# Altium project BLBB.PrjPcb
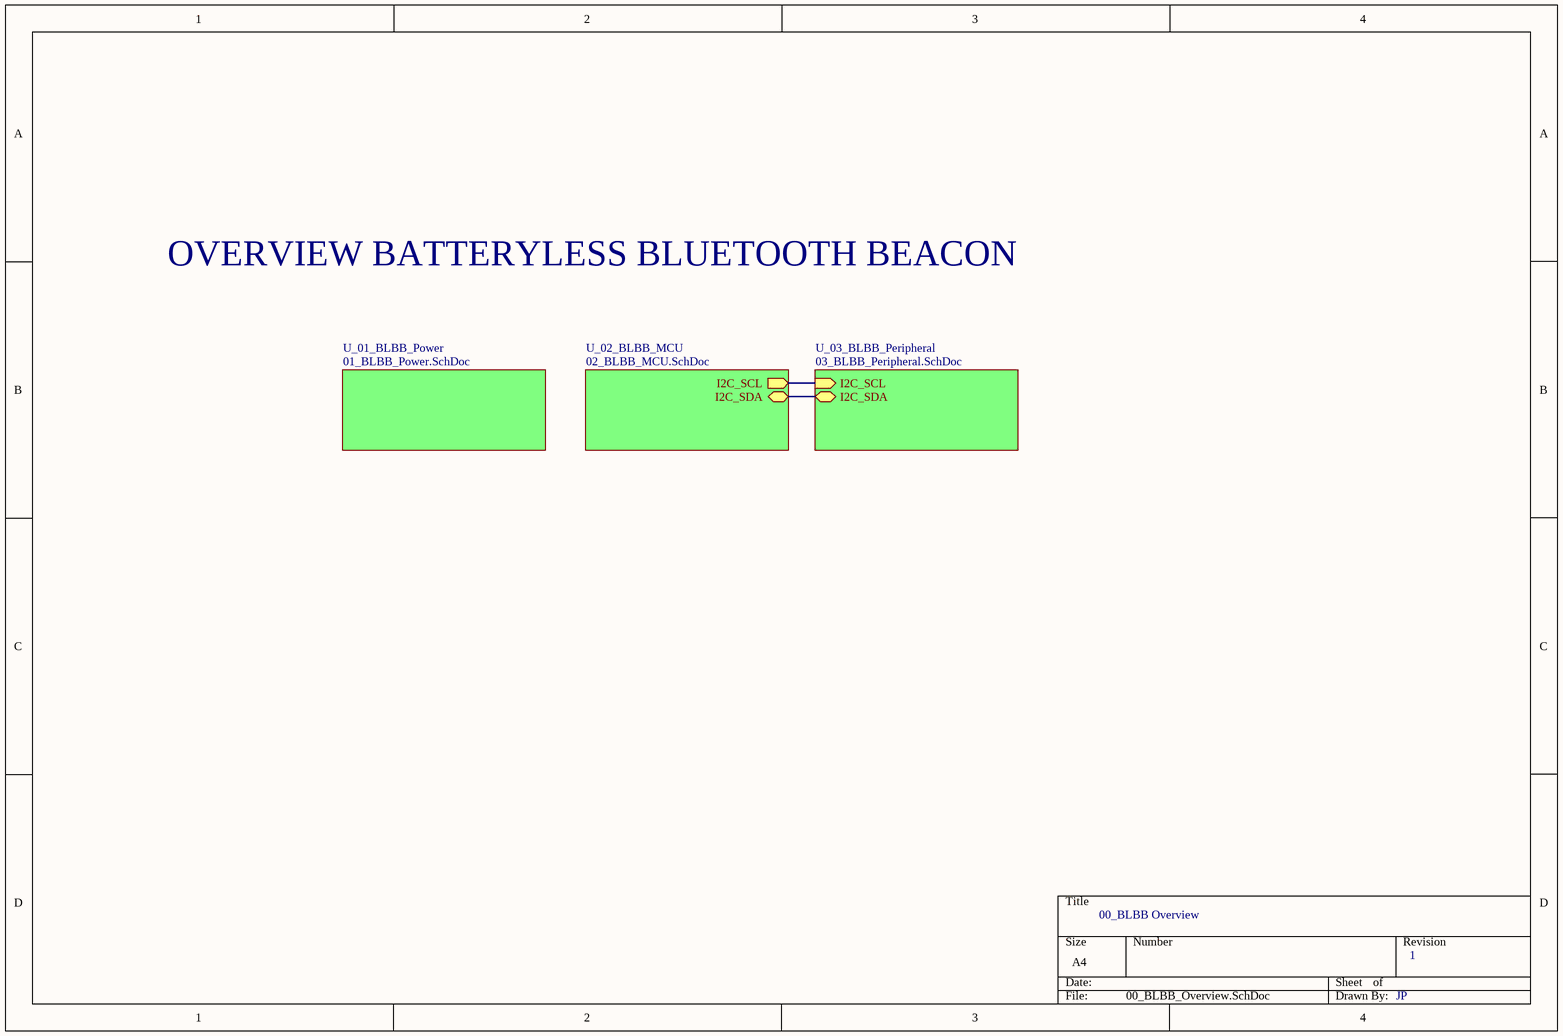
[diagram p0: 00_BLBB_Overview.SchDoc]
4 sheets, 46 parts. Net scope: hierarchical (ports join the sheet entries above them; power ports are global).
Board file: BLBB.PcbDoc
Sheets:
  00_BLBB_Overview.SchDoc
    U_01_BLBB_Power = 01_BLBB_Power.SchDoc
    U_02_BLBB_MCU = 02_BLBB_MCU.SchDoc
    U_03_BLBB_Peripheral = 03_BLBB_Peripheral.SchDoc

## Sheet 00_BLBB_Overview.SchDoc
size A4; SheetNumber: 1; SheetTotal: 4

### Sub-sheets
U_01_BLBB_Power = 01_BLBB_Power.SchDoc: no entries
U_02_BLBB_MCU = 02_BLBB_MCU.SchDoc: I2C_SCL (out), I2C_SDA (bidir)
U_03_BLBB_Peripheral = 03_BLBB_Peripheral.SchDoc: I2C_SCL (in), I2C_SDA (bidir)

### Nets
I2C_SCL: sheet U_02_BLBB_MCU/I2C_SCL, sheet U_03_BLBB_Peripheral/I2C_SCL
I2C_SDA: sheet U_02_BLBB_MCU/I2C_SDA, sheet U_03_BLBB_Peripheral/I2C_SDA

### Notes on the sheet
- OVERVIEW BATTERYLESS BLUETOOTH BEACON
- 00_BLBB Overview
- 1
- JP

## Sheet 01_BLBB_Power.SchDoc
size A4; SheetNumber: 2; SheetTotal: 4
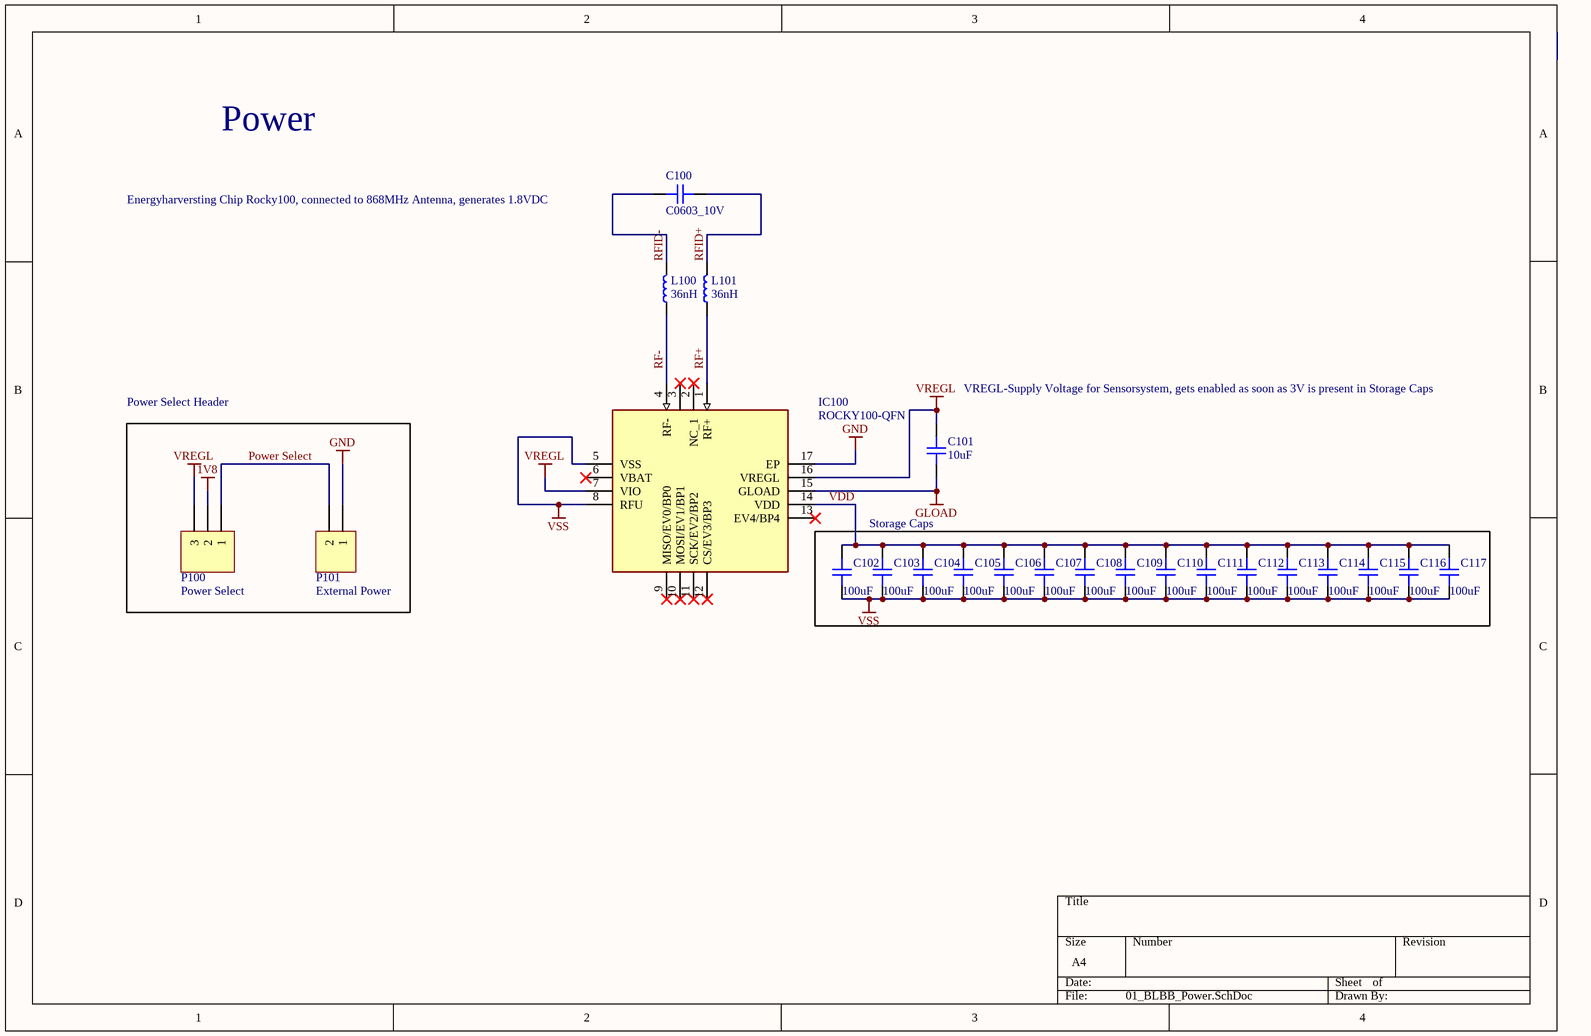
[diagram p1: 01_BLBB_Power.SchDoc]

### Parts
C100  C0603_10V  [CAP_0603]
C101  10uF  [CAP_0603]
C102  100uF  [CAP_1206]
C103  100uF  [CAP_1206]
C104  100uF  [CAP_1206]
C105  100uF  [CAP_1206]
C106  100uF  [CAP_1206]
C107  100uF  [CAP_1206]
C108  100uF  [CAP_1206]
C109  100uF  [CAP_1206]
C110  100uF  [CAP_1206]
C111  100uF  [CAP_1206]
C112  100uF  [CAP_1206]
C113  100uF  [CAP_1206]
C114  100uF  [CAP_1206]
C115  100uF  [CAP_1206]
C116  100uF  [CAP_1206]
C117  100uF  [CAP_1206]
IC100  ROCKY100-QFN  [QFN65P400X400X80-17N-D]
L100  36nH  [IND_0603]
L101  36nH  [IND_0603]
P100  Power Select  [HDR1X3]
P101  External Power  [HDR1X2]

### Blocks framed on the sheet
Power Select Header: P100 P101
Storage Caps: C102-C117

### Nets
1V8: P100.2
GLOAD: C101.1 IC100.15(GLOAD)
GND: IC100.17(EP) P101.1
VREGL: C101.2 IC100.7(VIO) IC100.16(VREGL) P100.3
VSS: C102.1 C103.1 C104.1 C105.1 C106.1 C107.1 C108.1 C109.1 C110.1 C111.1 C112.1 C113.1 C114.1 C115.1 C116.1 C117.1 IC100.5(VSS) IC100.8(RFU)
Power Select: P100.1 P101.2
RF+: IC100.1(RF+) L101.1
RF-: IC100.4(RF-) L100.1
RFID+: C100.2 L101.2
RFID-: C100.1 L100.2
VDD: C102.2 C103.2 C104.2 C105.2 C106.2 C107.2 C108.2 C109.2 C110.2 C111.2 C112.2 C113.2 C114.2 C115.2 C116.2 C117.2 IC100.14(VDD)

Not connected (* = marked no-connect by the designer): IC100 2(NC_1)* 3(NC_2)* 6(VBAT)* 9(MISO/EV0/BP0)* 10(MOSI/EV1/BP1)* 11(SCK/EV2/BP2)* 12(CS/EV3/BP3)* 13(EV4/BP4)*

### Notes on the sheet
- Power
- Energyharversting Chip Rocky100, connected to 868MHz Antenna, generates 1.8VDC
- (near C101) VREGL-Supply Voltage for Sensorsystem, gets enabled as soon as 3V is present in Storage Caps

### Library data of the parts
C100 C101 = CAP_0603_10V: Capacitor SMD 0603 10V
C102-C117 = CAP_1206_10V: Capacitor SMD 1206 10V
IC100 = ROCKY100-QFN: Integrated Circuit; Manufacturer_Name: Farsens; Datasheet Link: http://www.farsens.com/wp-content/uploads/2017/12/DS-ROCKY100-V04.pdf; Height: 0.8mm; Manufacturer_Part_Number: ROCKY100-QFN
L100 L101 = IND_0603: Inductor SMD 0603
P100 = Header 3: Header, 3-Pin; LatestRevisionDate: 17-Jul-2002; LatestRevisionNote: Re-released for DXP Platform.; Publisher: Altium Limited
P101 = Header 2: LatestRevisionDate: 17-Jul-2002; LatestRevisionNote: Re-released for DXP Platform.; Publisher: Altium Limited

## Sheet 02_BLBB_MCU.SchDoc
size A4; SheetNumber: 3; SheetTotal: 4
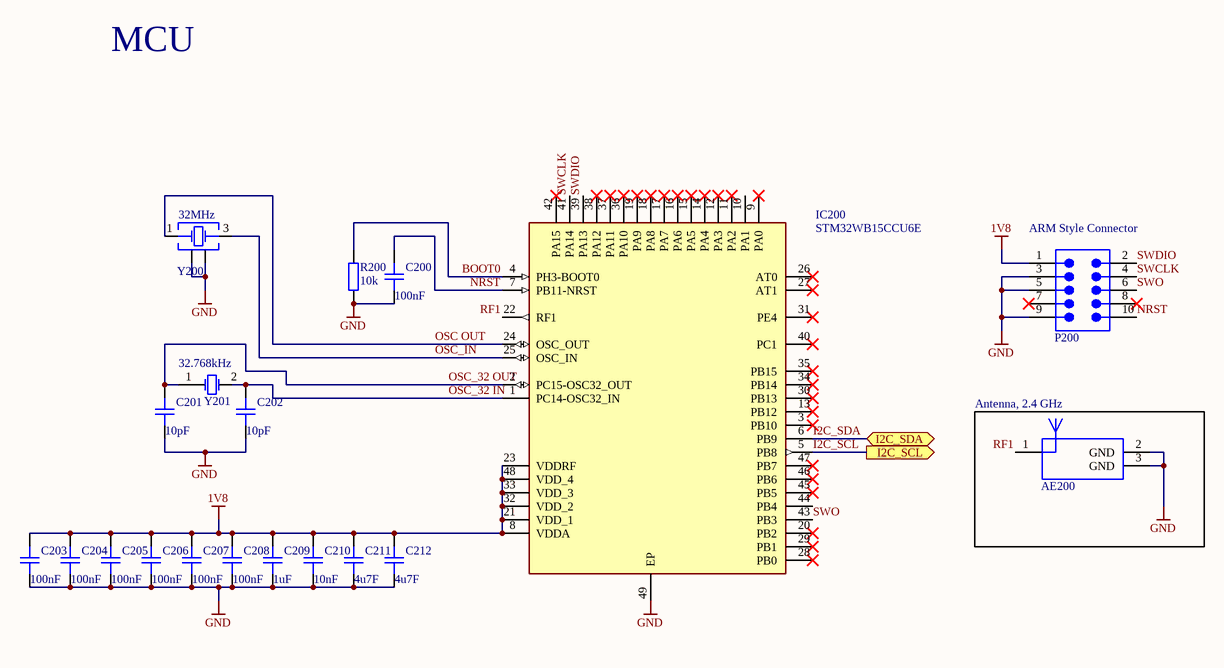
[diagram p2: 02_BLBB_MCU.SchDoc]

### Parts
AE200  7488960245  [7488960245]  (value not drawn)
C200  100nF  [CAP_0603]
C201  10pF  [CAP_0603]
C202  10pF  [CAP_0603]
C203  100nF  [CAP_0603]
C204  100nF  [CAP_0603]
C205  100nF  [CAP_0603]
C206  100nF  [CAP_0603]
C207  100nF  [CAP_0603]
C208  100nF  [CAP_0603]
C209  1uF  [CAP_0603]
C210  10nF  [CAP_0603]
C211  4u7F  [CAP_0603]
C212  4u7F  [CAP_0603]
IC200  STM32WB15CCU6E  [QFN50P700X700X65-49N-D]
P200  62701020621  [62701020621]  (value not drawn)
R200  10k  [RES_0603]
Y200  32MHz  [WE-XTAL_CFPX-180]
Y201  32.768kHz  [WE-XTAL_CFPX-217]

### Blocks framed on the sheet
Antenna, 2.4 GHz: AE200

### Ports
I2C_SCL (out), I2C_SDA (bidir)

### Nets
1V8: C203.2 C204.2 C205.2 C206.2 C207.2 C208.2 C209.2 C210.2 C211.2 C212.2 IC200.8(VDDA) IC200.21(VDD_1) IC200.23(VDDRF) IC200.32(VDD_2) IC200.33(VDD_3) IC200.48(VDD_4) P200.1
GND: AE200.2(GND) AE200.3(GND) C200.1 C201.1 C202.1 C203.1 C204.1 C205.1 C206.1 C207.1 C208.1 C209.1 C210.1 C211.1 C212.1 IC200.49(EP) P200.3 P200.5 P200.9 R200.1 Y200.2(GND&Lid) Y200.4(GND&Lid)
BOOT0: IC200.4(PH3-BOOT0) R200.2
I2C_SCL: IC200.5(PB8) ; port I2C_SCL
I2C_SDA: IC200.6(PB9) ; port I2C_SDA
NRST: C200.2 IC200.7(PB11-NRST) P200.10
OSC OUT: IC200.24(OSC_OUT) Y200.1(Crystal)
OSC_32 IN: C202.2 IC200.1(PC14-OSC32_IN) Y201.2(OSC2)
OSC_32 OUT: C201.2 IC200.2(PC15-OSC32_OUT) Y201.1(OSC1)
OSC_IN: IC200.25(OSC_IN) Y200.3(Crystal)
RF1: AE200.1(Feed) IC200.22(RF1)
SWCLK: IC200.41(PA14) P200.4
SWDIO: IC200.39(PA13) P200.2
SWO: IC200.43(PB3) P200.6

Not connected (* = marked no-connect by the designer): IC200 3(PB10)* 9(PA0)* 10(PA1) 11(PA2)* 12(PA3)* 13(PB12)* 14(PA4)* 15(PA5)* 16(PA6)* 17(PA7)* 18(PA8)* 19(PA9)* 20(PB2)* 26(AT0)* 27(AT1)* 28(PB0)* 29(PB1)* 30(PB13)* 31(PE4)* 34(PB14)* 35(PB15)* 36(PA10)* 37(PA11)* 38(PA12)* 40(PC1)* 42(PA15)* 44(PB4) 45(PB5)* 46(PB6)* 47(PB7)*; P200 7* 8*

### Notes on the sheet
- MCU
- (near P200) ARM Style Connector

### Library data of the parts
AE200 = 7488960245: WE-MCA SMT Multilayer Chip Antenna, 1 Band, 2400-2500MHz, 50Ω; Manufacturer: Wurth Elektronik; Number of Bands: 1; Peak Gain: 3dBi; VSWR: 2.5; ComponentLink1Description: Website Link; ComponentLink1URL: https://www.we-online.com/redexpert/article/7488960245?ad; ComponentLink2Description: Datasheet Link; ComponentLink2URL: https://www.we-online.com/redexpert/spec/7488960245?ad; Manufacturer Part Number: 7488960245; Category: Antennas; Match Code: WE-MCA; Mount: Surface Mount; Operating Temperature Max: 85°C; Operating Temperature Min: -40°C; Packaging: Tape and Reel; Length: 5.2mm; Width: 3.7mm; Height: 0.7mm; Frequency Range: 2400-2500MHz; Impedance: 50Ω
C200-C212 = CAP_0603_10V: Capacitor SMD 0603 10V
IC200 = STM32WB15CCU6E: Integrated Circuit; Manufacturer_Name: STMicroelectronics; Datasheet Link: https://www.st.com/resource/en/datasheet/stm32wb15cc.pdf; Height: 0.65mm; Manufacturer_Part_Number: STM32WB15CCU6E; Mouser Part Number: 511-STM32WB15CCU6E; Mouser Price/Stock: https://www.mouser.co.uk/ProductDetail/STMicroelectronics/STM32WB15CCU6E?qs=DRkmTr78QARFXKemW9838Q%3D%3D; Arrow Part Number: STM32WB15CCU6E; Arrow Price/Stock: https://www.arrow.com/en/products/stm32wb15ccu6e/stmicroelectronics?region=nac
P200 = 62701020621: WR-BHD Male Box Header, SMT Straight, pitch 1.27mm, 10pins; Manufacturer: Wurth Elektronik; Contact Resistance: 20mΩ; Insulation Resistance: 1000MΩ; Rated Current: 1A; Working Voltage: 50V; Withstanding Voltage: 500V; ComponentLink1Description: Website Link; ComponentLink1URL: https://www.we-online.com/redexpert/article/62701020621?ad; ComponentLink2Description: Datasheet Link; ComponentLink2URL: https://www.we-online.com/redexpert/spec/62701020621?ad; Manufacturer Part Number: 62701020621; Category: Wire-to-Board Connectors; Match Code: WR-BHD; Mount: Surface Mount; Operating Temperature Max: 105°C; Operating Temperature Min: -40°C; Packaging: Tape and Reel; Length: 12.7mm; Width: 5mm; Height: 5.3mm; Gender: Male; Number of Pins: 10; Number of Rows: 2; Orientation: Straight; Pitch: 1.27mm
R200 = RES_0603: Resistor SMD 0603
Y200 = 830060258: WE-XTAL Quartz Crystal, SMT, CFPX-180, 32MHz, +/-30ppm; Manufacturer: Wurth Elektronik; Load Capacitance: 10pF; ComponentLink1Description: Website Link; ComponentLink1URL: https://www.we-online.com/redexpert/article/830060258?ad; ComponentLink2Description: Datasheet Link; ComponentLink2URL: https://www.we-online.com/redexpert/spec/830060258?ad; Manufacturer Part Number: 830060258; Category: Crystals; Match Code: WE-XTAL; Mount: Surface Mount; Operating Temperature Max: 70°C; Operating Temperature Min: -20°C; Packaging: Tape and Reel; Case/Size Code: CFPX-180; Length: 3.4mm; Width: 2.7mm; Height: 0.8mm; Frequency: 32MHz; Frequency Stability: +/-30ppm; Frequency Tolerance: +/-30ppm
Y201 = 830009709: WE-XTAL Watch Crystal, SMT, CFPX-217, 32.768kHz, +/-20ppm; Manufacturer: Wurth Elektronik; Load Capacitance: 7pF; ComponentLink1Description: Website Link; ComponentLink1URL: https://www.we-online.com/redexpert/article/830009709?ad; ComponentLink2Description: Datasheet Link; ComponentLink2URL: https://www.we-online.com/redexpert/spec/830009709?ad; Manufacturer Part Number: 830009709; Category: Crystals; Match Code: WE-XTAL; Mount: Surface Mount; Operating Temperature Max: 85°C; Operating Temperature Min: -40°C; Packaging: Tape and Reel; Case/Size Code: CFPX-217; Length: 3.2mm; Width: 1.5mm; Height: 0.9mm; Frequency: 32.768kHz; Frequency Tolerance: +/-20ppm

## Sheet 03_BLBB_Peripheral.SchDoc
size A4; SheetNumber: 4; SheetTotal: 4
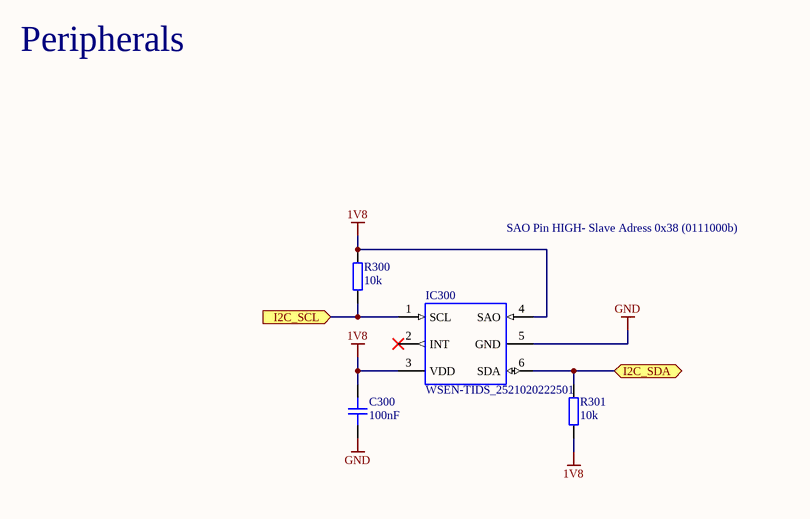
[diagram p3: 03_BLBB_Peripheral.SchDoc]

### Parts
C300  100nF  [CAP_0603]
IC300  WSEN-TIDS_2521020222501  [WSEN-TIDS_2521020222501]
R300  10k  [RES_0603]
R301  10k  [RES_0603]

### Ports
I2C_SCL (in), I2C_SDA (bidir)

### Nets
1V8: C300.2 IC300.3(VDD) IC300.4(SAO) R300.2 R301.1
GND: C300.1 IC300.5(GND)
I2C_SCL: IC300.1(SCL) R300.1 ; port I2C_SCL
I2C_SDA: IC300.6(SDA) R301.2 ; port I2C_SDA

Not connected (* = marked no-connect by the designer): IC300 2(INT)*

### Notes on the sheet
- Peripherals
- SAO Pin HIGH- Slave Adress 0x38 (0111000b)

### Library data of the parts
C300 = CAP_0603_10V: Capacitor SMD 0603 10V
IC300 = WSEN-TIDS_2521020222501: Manufacturer: Würth Elektronik; NR: 2521020222501
R300 R301 = RES_0603: Resistor SMD 0603

## Nets that join several sheets
1V8: 01_BLBB_Power (P100.2), 02_BLBB_MCU (17 pins), 03_BLBB_Peripheral (5 pins)
GND: 01_BLBB_Power (IC100.17 P101.1), 02_BLBB_MCU (22 pins), 03_BLBB_Peripheral (C300.1 IC300.5)
I2C_SCL: 02_BLBB_MCU (IC200.5), 03_BLBB_Peripheral (IC300.1 R300.1)
I2C_SDA: 02_BLBB_MCU (IC200.6), 03_BLBB_Peripheral (IC300.6 R301.2)